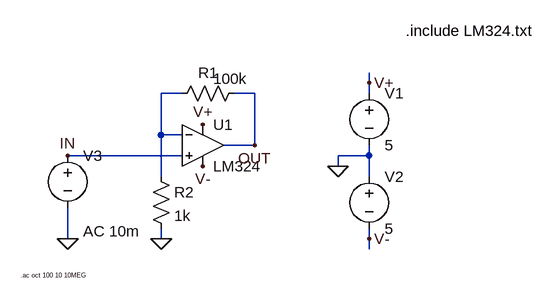
[diagram p0: schematic op_amp_test_circuit.asc]
op_amp_test_circuit.asc, the LTspice schematic file:
Version 4
SHEET 1 880 680
WIRE 416 0 416 -16
WIRE 128 16 96 16
WIRE 240 16 208 16
WIRE 416 16 416 0
WIRE 96 80 96 16
WIRE 128 80 96 80
WIRE 240 96 240 16
WIRE 240 96 192 96
WIRE 128 112 -48 112
WIRE 416 112 416 96
WIRE 416 112 368 112
WIRE 368 128 368 112
WIRE 96 144 96 80
WIRE 416 144 416 112
WIRE -48 240 -48 192
WIRE 96 240 96 224
WIRE 416 240 416 224
WIRE 416 256 416 240
FLAG 368 128 0
FLAG 416 0 V+
FLAG 416 240 V-
FLAG -48 112 IN
FLAG 240 96 OUT
FLAG -48 240 0
FLAG 96 240 0
FLAG 160 64 V+
FLAG 160 128 V-
SYMBOL voltage 416 0 R0
WINDOW 123 0 0 Left 2
WINDOW 39 0 0 Left 2
SYMATTR InstName V1
SYMATTR Value 5
SYMBOL voltage 416 128 R0
WINDOW 123 0 0 Left 2
WINDOW 39 0 0 Left 2
SYMATTR InstName V2
SYMATTR Value 5
SYMBOL voltage -48 96 R0
WINDOW 123 24 132 Left 2
WINDOW 39 0 0 Left 2
SYMATTR Value2 AC 10m
SYMATTR InstName V3
SYMATTR Value ""
SYMBOL res 224 0 R90
WINDOW 0 0 56 VBottom 2
WINDOW 3 -22 22 VTop 2
SYMATTR InstName R1
SYMATTR Value 100k
SYMBOL res 80 128 R0
SYMATTR InstName R2
SYMATTR Value 1k
SYMBOL Opamps\\opamp2 160 32 R0
SYMATTR InstName U1
SYMATTR Value LM324
TEXT -120 296 Left 0 !.ac oct 100 10 10MEG
TEXT 472 -80 Left 2 !.include LM324.txt

The netlist it stands for:
* op_amp_test_circuit.asc
V1 V+ 0 5
V2 0 V- 5
V3 IN 0 AC 10m
R1 OUT N001 100k
R2 N001 0 1k
XU1 IN N001 V+ V- OUT LM324  ; pins In+ In- V+ V- OUT
.ac oct 100 10 10MEG
.include LM324.txt
.backanno
.end